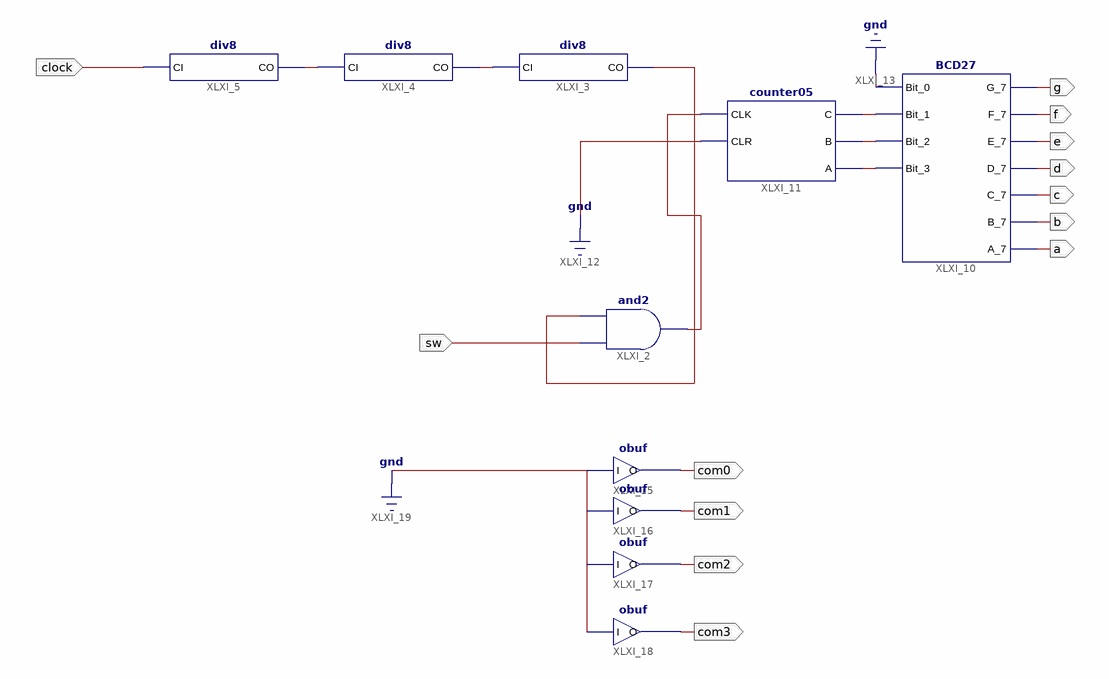
[diagram p0: schematic sheet 1]
// Xilinx ISE schematic testClock.sch (spartan6) as structural Verilog: 10 symbols, 13 ports
module testClock (
  input  clock,
  input  sw,
  output g,
  output f,
  output e,
  output c,
  output d,
  output b,
  output a,
  output com0,
  output com1,
  output com2,
  output com3
);

  wire led, XLXN_6, XLXN_8, XLXN_14, XLXN_15, XLXN_16, XLXN_22;

  div8 XLXI_3 (.CI(XLXN_6), .CO(XLXN_22));
  div8 XLXI_4 (.CI(XLXN_8), .CO(XLXN_6));
  div8 XLXI_5 (.CI(clock), .CO(XLXN_8));
  BCD27 XLXI_10 (
    .A_7(a), .Bit_0(1'b0), .Bit_1(XLXN_16), .Bit_2(XLXN_15), .Bit_3(XLXN_14), .B_7(b), .C_7(c), .D_7(d),
    .E_7(e), .F_7(f), .G_7(g));
  counter05 XLXI_11 (.A(XLXN_14), .B(XLXN_15), .C(XLXN_16), .CLK(led), .CLR(1'b0));
  and XLXI_2 (led, sw, XLXN_22);
  obuf XLXI_15 (.I(1'b0), .O(com0));
  obuf XLXI_16 (.I(1'b0), .O(com1));
  obuf XLXI_17 (.I(1'b0), .O(com2));
  obuf XLXI_18 (.I(1'b0), .O(com3));
endmodule
